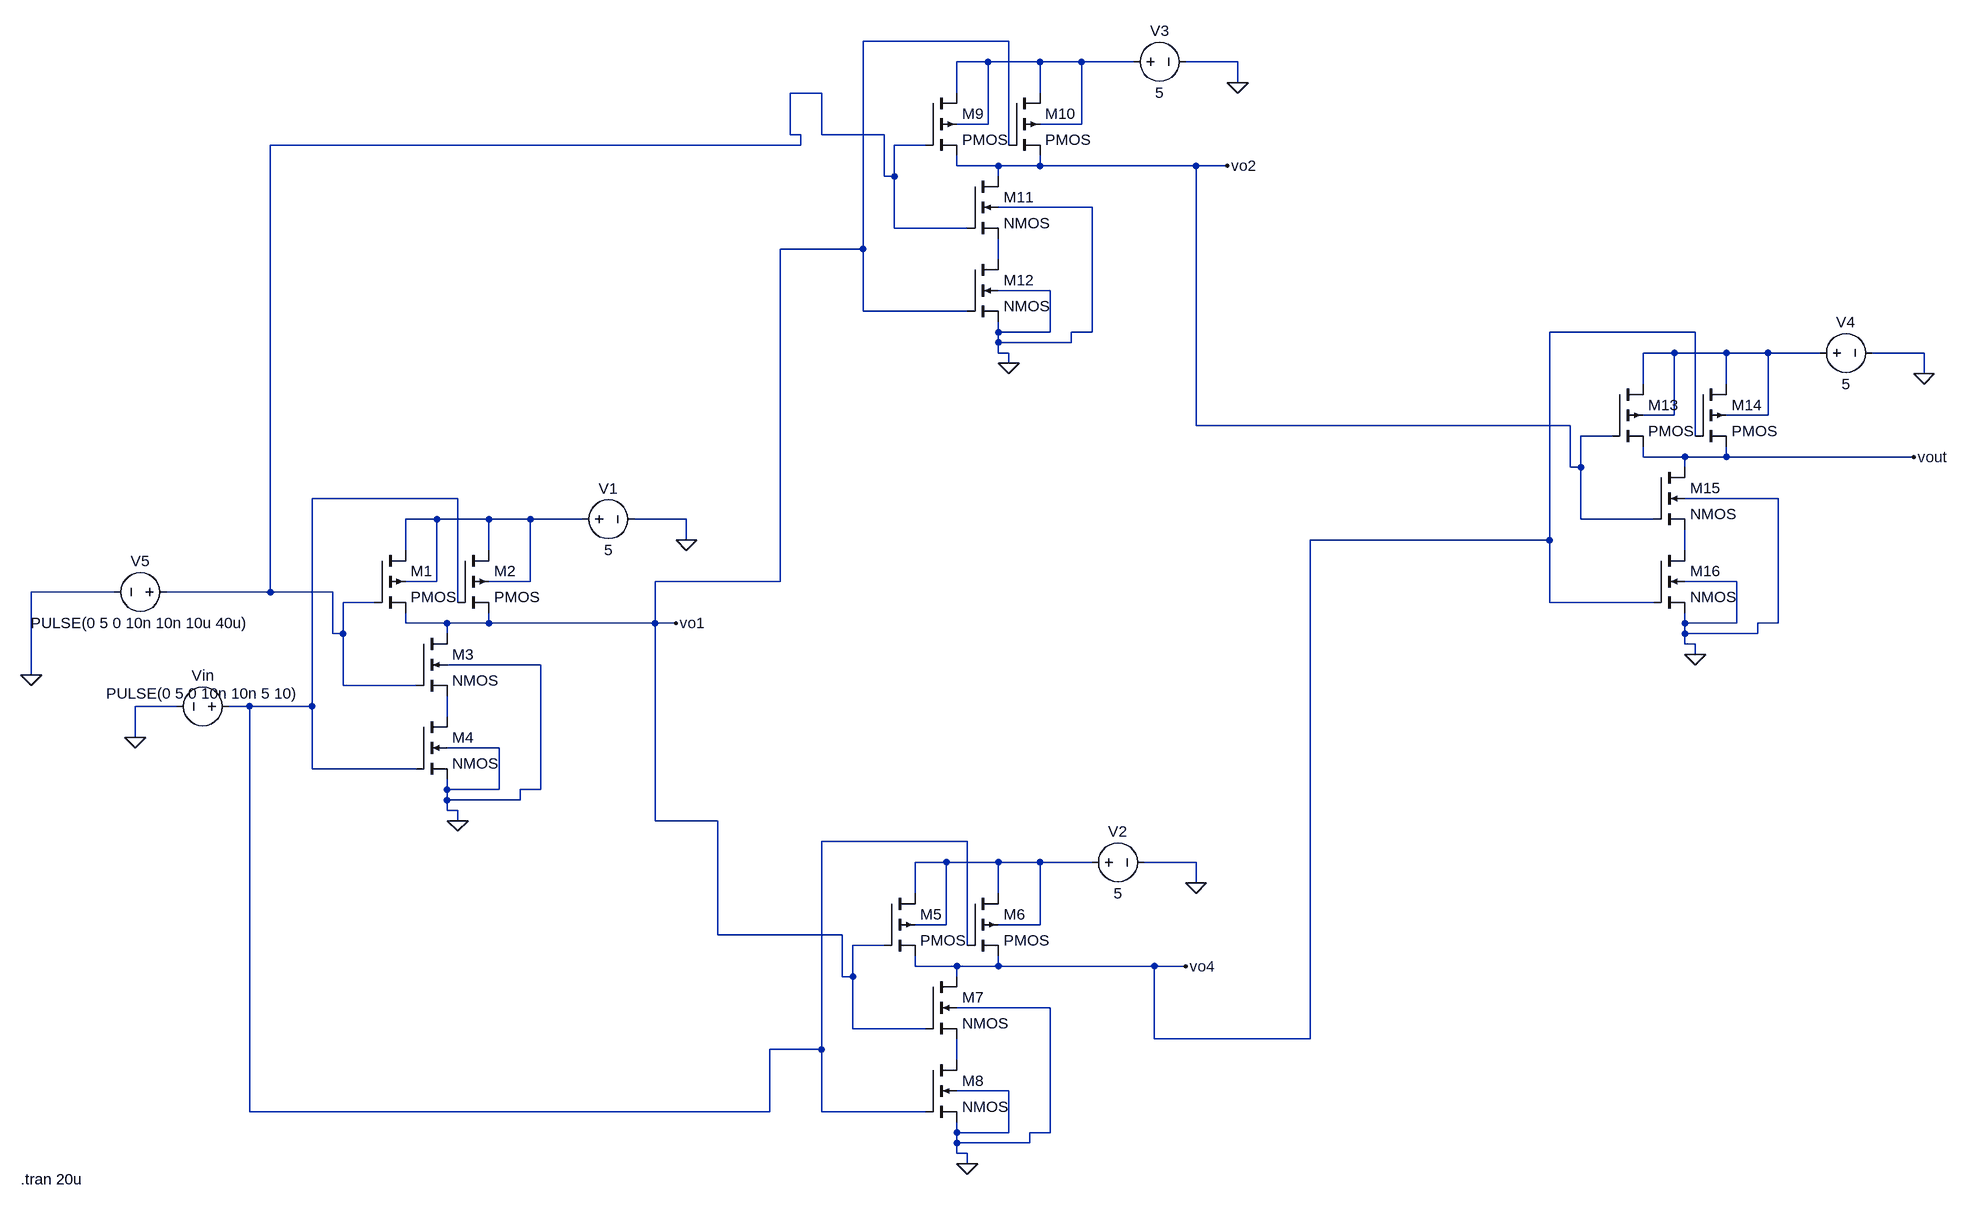
[diagram p0: schematic xor.asc]
xor.asc, the LTspice schematic file:
Version 4.1
SHEET 1 2452 1048
WIRE 992 -720 768 -720
WIRE 960 -688 912 -688
WIRE 1040 -688 960 -688
WIRE 1104 -688 1040 -688
WIRE 1184 -688 1104 -688
WIRE 1344 -688 1264 -688
WIRE 1344 -656 1344 -688
WIRE 704 -640 656 -640
WIRE 912 -640 912 -688
WIRE 1040 -640 1040 -688
WIRE 960 -592 960 -688
WIRE 960 -592 912 -592
WIRE 1104 -592 1104 -688
WIRE 1104 -592 1040 -592
WIRE 656 -576 656 -640
WIRE 672 -576 656 -576
WIRE 704 -576 704 -640
WIRE 800 -576 704 -576
WIRE 672 -560 672 -576
WIRE 672 -560 -144 -560
WIRE 864 -560 816 -560
WIRE 992 -560 992 -720
WIRE 912 -528 912 -544
WIRE 976 -528 912 -528
WIRE 1040 -528 1040 -544
WIRE 1040 -528 976 -528
WIRE 1280 -528 1040 -528
WIRE 1328 -528 1280 -528
WIRE 800 -512 800 -576
WIRE 816 -512 816 -560
WIRE 816 -512 800 -512
WIRE 976 -512 976 -528
WIRE 1120 -464 976 -464
WIRE 816 -432 816 -512
WIRE 928 -432 816 -432
WIRE 768 -400 768 -720
WIRE 768 -400 640 -400
WIRE 976 -384 976 -416
WIRE 1056 -336 976 -336
WIRE 768 -304 768 -400
WIRE 928 -304 768 -304
WIRE 976 -272 976 -288
WIRE 1056 -272 1056 -336
WIRE 1056 -272 976 -272
WIRE 1120 -272 1120 -464
WIRE 1120 -272 1088 -272
WIRE 2048 -272 1824 -272
WIRE 976 -256 976 -272
WIRE 1088 -256 1088 -272
WIRE 1088 -256 976 -256
WIRE 976 -240 976 -256
WIRE 992 -240 976 -240
WIRE 2016 -240 1968 -240
WIRE 2096 -240 2016 -240
WIRE 2160 -240 2096 -240
WIRE 2240 -240 2160 -240
WIRE 2400 -240 2320 -240
WIRE 992 -224 992 -240
WIRE 2400 -208 2400 -240
WIRE 1968 -192 1968 -240
WIRE 2096 -192 2096 -240
WIRE 2016 -144 2016 -240
WIRE 2016 -144 1968 -144
WIRE 2160 -144 2160 -240
WIRE 2160 -144 2096 -144
WIRE 1280 -128 1280 -528
WIRE 1856 -128 1280 -128
WIRE 1920 -112 1872 -112
WIRE 2048 -112 2048 -272
WIRE 1968 -80 1968 -96
WIRE 2032 -80 1968 -80
WIRE 2096 -80 2096 -96
WIRE 2096 -80 2032 -80
WIRE 2384 -80 2096 -80
WIRE 1856 -64 1856 -128
WIRE 1872 -64 1872 -112
WIRE 1872 -64 1856 -64
WIRE 2032 -64 2032 -80
WIRE 144 -16 -80 -16
WIRE 2176 -16 2032 -16
WIRE 112 16 64 16
WIRE 192 16 112 16
WIRE 256 16 192 16
WIRE 336 16 256 16
WIRE 496 16 416 16
WIRE 1872 16 1872 -64
WIRE 1984 16 1872 16
WIRE 496 48 496 16
WIRE 1824 48 1824 -272
WIRE 1824 48 1456 48
WIRE 64 64 64 16
WIRE 192 64 192 16
WIRE 2032 64 2032 32
WIRE 112 112 112 16
WIRE 112 112 64 112
WIRE 256 112 256 16
WIRE 256 112 192 112
WIRE 640 112 640 -400
WIRE 640 112 448 112
WIRE 2112 112 2032 112
WIRE -384 128 -512 128
WIRE -144 128 -144 -560
WIRE -144 128 -304 128
WIRE -48 128 -144 128
WIRE 16 144 -32 144
WIRE 144 144 144 -16
WIRE 1824 144 1824 48
WIRE 1984 144 1824 144
WIRE 64 176 64 160
WIRE 128 176 64 176
WIRE 192 176 192 160
WIRE 192 176 128 176
WIRE 448 176 448 112
WIRE 448 176 192 176
WIRE 480 176 448 176
WIRE 2032 176 2032 160
WIRE 2112 176 2112 112
WIRE 2112 176 2032 176
WIRE 2176 176 2176 -16
WIRE 2176 176 2144 176
WIRE -48 192 -48 128
WIRE -32 192 -32 144
WIRE -32 192 -48 192
WIRE 128 192 128 176
WIRE 2032 192 2032 176
WIRE 2144 192 2144 176
WIRE 2144 192 2032 192
WIRE 2032 208 2032 192
WIRE 2048 208 2032 208
WIRE 2048 224 2048 208
WIRE 272 240 128 240
WIRE -512 256 -512 128
WIRE -32 272 -32 192
WIRE 80 272 -32 272
WIRE -288 304 -352 304
WIRE -176 304 -208 304
WIRE -80 304 -80 -16
WIRE -80 304 -176 304
WIRE 128 320 128 288
WIRE -352 352 -352 304
WIRE 208 368 128 368
WIRE -80 400 -80 304
WIRE 80 400 -80 400
WIRE 128 432 128 416
WIRE 208 432 208 368
WIRE 208 432 128 432
WIRE 272 432 272 240
WIRE 272 432 240 432
WIRE 128 448 128 432
WIRE 240 448 240 432
WIRE 240 448 128 448
WIRE 128 464 128 448
WIRE 144 464 128 464
WIRE 144 480 144 464
WIRE 448 480 448 176
WIRE 544 480 448 480
WIRE 928 512 704 512
WIRE 896 544 848 544
WIRE 976 544 896 544
WIRE 1040 544 976 544
WIRE 1120 544 1040 544
WIRE 1280 544 1200 544
WIRE 1280 576 1280 544
WIRE 848 592 848 544
WIRE 976 592 976 544
WIRE 896 640 896 544
WIRE 896 640 848 640
WIRE 1040 640 1040 544
WIRE 1040 640 976 640
WIRE 544 656 544 480
WIRE 736 656 544 656
WIRE 800 672 752 672
WIRE 928 672 928 512
WIRE 848 704 848 688
WIRE 912 704 848 704
WIRE 976 704 976 688
WIRE 976 704 912 704
WIRE 1216 704 976 704
WIRE 1264 704 1216 704
WIRE 736 720 736 656
WIRE 752 720 752 672
WIRE 752 720 736 720
WIRE 912 720 912 704
WIRE 1056 768 912 768
WIRE 752 800 752 720
WIRE 864 800 752 800
WIRE 1216 816 1216 704
WIRE 1456 816 1456 48
WIRE 1456 816 1216 816
WIRE 704 832 704 512
WIRE 704 832 624 832
WIRE 912 848 912 816
WIRE 992 896 912 896
WIRE -176 928 -176 304
WIRE 624 928 624 832
WIRE 624 928 -176 928
WIRE 704 928 704 832
WIRE 864 928 704 928
WIRE 912 960 912 944
WIRE 992 960 992 896
WIRE 992 960 912 960
WIRE 1056 960 1056 768
WIRE 1056 960 1024 960
WIRE 912 976 912 960
WIRE 1024 976 1024 960
WIRE 1024 976 912 976
WIRE 912 992 912 976
WIRE 928 992 912 992
WIRE 928 1008 928 992
FLAG 496 48 0
FLAG 144 480 0
FLAG 480 176 vo1
FLAG -352 352 0
FLAG 1280 576 0
FLAG 928 1008 0
FLAG 1264 704 vo4
FLAG 1344 -656 0
FLAG 992 -224 0
FLAG 1328 -528 vo2
FLAG 2400 -208 0
FLAG 2048 224 0
FLAG 2384 -80 vout
FLAG -512 256 0
SYMBOL pmos4 16 64 R0
SYMATTR InstName M1
SYMBOL pmos4 144 64 R0
SYMATTR InstName M2
SYMBOL nmos4 80 192 R0
SYMATTR InstName M3
SYMBOL nmos4 80 320 R0
SYMATTR InstName M4
SYMBOL voltage 320 16 R270
WINDOW 0 32 56 VTop 2
WINDOW 3 -32 56 VBottom 2
WINDOW 123 0 0 Left 0
WINDOW 39 0 0 Left 0
SYMATTR InstName V1
SYMATTR Value 5
SYMBOL voltage -192 304 R90
WINDOW 0 -32 56 VBottom 2
WINDOW 3 -4 56 VBottom 2
WINDOW 123 0 0 Left 0
WINDOW 39 0 0 Left 0
SYMATTR InstName Vin
SYMATTR Value PULSE(0 5 0 10n 10n 5 10)
SYMBOL pmos4 800 592 R0
SYMATTR InstName M5
SYMBOL pmos4 928 592 R0
SYMATTR InstName M6
SYMBOL nmos4 864 720 R0
SYMATTR InstName M7
SYMBOL nmos4 864 848 R0
SYMATTR InstName M8
SYMBOL voltage 1104 544 R270
WINDOW 0 32 56 VTop 2
WINDOW 3 -32 56 VBottom 2
WINDOW 123 0 0 Left 0
WINDOW 39 0 0 Left 0
SYMATTR InstName V2
SYMATTR Value 5
SYMBOL pmos4 864 -640 R0
SYMATTR InstName M9
SYMBOL pmos4 992 -640 R0
SYMATTR InstName M10
SYMBOL nmos4 928 -512 R0
SYMATTR InstName M11
SYMBOL nmos4 928 -384 R0
SYMATTR InstName M12
SYMBOL voltage 1168 -688 R270
WINDOW 0 32 56 VTop 2
WINDOW 3 -32 56 VBottom 2
WINDOW 123 0 0 Left 0
WINDOW 39 0 0 Left 0
SYMATTR InstName V3
SYMATTR Value 5
SYMBOL pmos4 1920 -192 R0
SYMATTR InstName M13
SYMBOL pmos4 2048 -192 R0
SYMATTR InstName M14
SYMBOL nmos4 1984 -64 R0
SYMATTR InstName M15
SYMBOL nmos4 1984 64 R0
SYMATTR InstName M16
SYMBOL voltage 2224 -240 R270
WINDOW 0 32 56 VTop 2
WINDOW 3 -32 56 VBottom 2
WINDOW 123 0 0 Left 0
WINDOW 39 0 0 Left 0
SYMATTR InstName V4
SYMATTR Value 5
SYMBOL voltage -288 128 R90
WINDOW 0 -32 56 VBottom 2
WINDOW 3 32 56 VTop 2
WINDOW 123 0 0 Left 0
WINDOW 39 0 0 Left 0
SYMATTR InstName V5
SYMATTR Value PULSE(0 5 0 10n 10n 10u 40u)
TEXT -528 1032 Left 2 !.tran 20u

The netlist it stands for:
* xor.asc
M1 N006 N002 vo1 N006 PMOS
M2 N006 N005 vo1 N006 PMOS
M3 vo1 N002 N008 0 NMOS
M4 N008 N005 0 0 NMOS
V1 N006 0 5
Vin N005 0 PULSE(0 5 0 10n 10n 5 10)
M5 N009 vo1 vo4 N009 PMOS
M6 N009 N005 vo4 N009 PMOS
M7 vo4 vo1 N010 0 NMOS
M8 N010 N005 0 0 NMOS
V2 N009 0 5
M9 N001 N002 vo2 N001 PMOS
M10 N001 vo1 vo2 N001 PMOS
M11 vo2 N002 N003 0 NMOS
M12 N003 vo1 0 0 NMOS
V3 N001 0 5
M13 N004 vo2 vout N004 PMOS
M14 N004 vo4 vout N004 PMOS
M15 vout vo2 N007 0 NMOS
M16 N007 vo4 0 0 NMOS
V4 N004 0 5
V5 N002 0 PULSE(0 5 0 10n 10n 10u 40u)
.model NMOS NMOS
.model PMOS PMOS
.lib standard.mos
.tran 20u
.backanno
.end